# Altium schematic sheet Flash.SchDoc
size A3; Organization: Altium Limited; Address1: L3, 12a Rodborough Rd; Address2: Frenchs Forest; Address3: NSW; Address4: Australia 2086; SheetNumber: 3; SheetTotal: 4
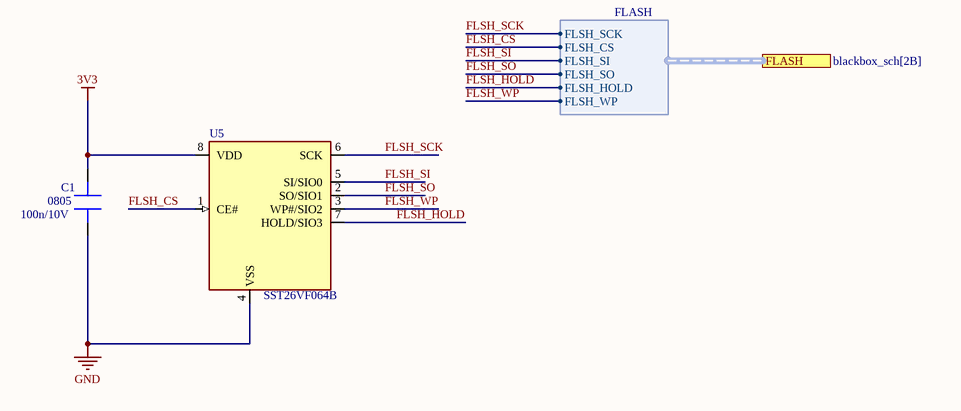
[diagram p0: Flash.SchDoc]

## Parts
C1  value 100n/10V  Package: 0805  [CAPC2012X09L [0805]]  (hidden comment: C)
U5  PN: SST26VF064B  [SON127P500X80-8N_T]  (hidden comment: SST26VF064B/BA)

## Ports
FLASH (harness FLASH, see blackbox_sch[2B])

## Harnesses
FLASH: FLSH_SCK, FLSH_CS, FLSH_SI, FLSH_SO, FLSH_HOLD, FLSH_WP

## Nets
3V3: C1.2 U5.8(VDD)
GND: C1.1 U5.4(VSS)
FLSH_CS: U5.1(CE#) ; port FLASH.FLSH_CS
FLSH_HOLD: U5.7(HOLD/SIO3) ; port FLASH.FLSH_HOLD
FLSH_SCK: U5.6(SCK) ; port FLASH.FLSH_SCK
FLSH_SI: U5.5(SI/SIO0) ; port FLASH.FLSH_SI
FLSH_SO: U5.2(SO/SIO1) ; port FLASH.FLSH_SO
FLSH_WP: U5.3(WP#/SIO2) ; port FLASH.FLSH_WP

## Notes on the sheet
- TITLE:
- PROJECT:
- FILE NAME:
- DRAWN BY:
- CHECKED BY:
- DATE:
- SHEET NO.:
- PROJ. REV.:
- OF
- SHEET REV.:
- SIZE:
- A3

## Library data of the parts
C1 = C: Standard capacitor
U5 = SST26VF064B/BA: 64 Mbit Serial Quad I/O (SQI) Flash Memory, 2V5/3V; HelpURL: http://ww1.microchip.com/downloads/en/DeviceDoc/SST26VF064B-SST26VF064BA-2.5V-3.0V-64-Mbit-Serial-Quad-IO-Flash-Memory-Data-Sheet-DS20005119J.pdf